# Altium schematic sheet DCAR_MCU.SchDoc: eBox_MCU
size A4; DocumentNumber: 3; SheetNumber: 3; SheetTotal: 7
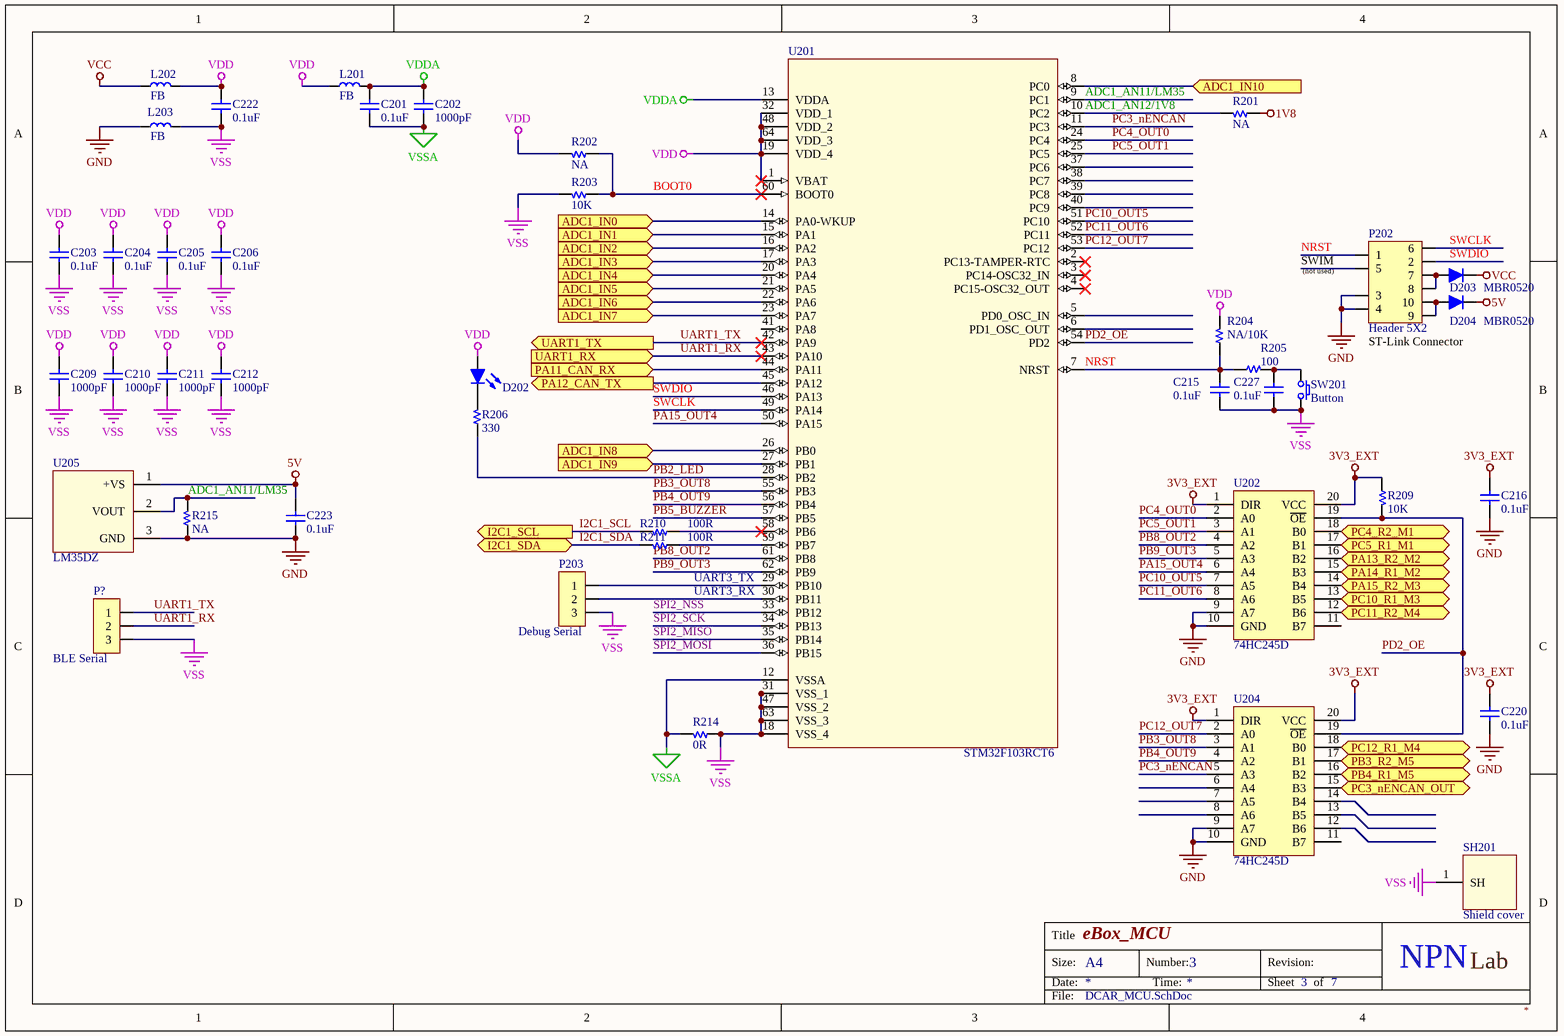
[diagram p0: DCAR_MCU.SchDoc]

## Parts
C201  0.1uF  [C 0603]
C202  1000pF  [C 0603]
C203  0.1uF  [C 0603]
C204  0.1uF  [C 0603]
C205  0.1uF  [C 0603]
C206  0.1uF  [C 0603]
C209  1000pF  [C 0603]
C210  1000pF  [C 0603]
C211  1000pF  [C 0603]
C212  1000pF  [C 0603]
C215  0.1uF  [C 0603]
C216  0.1uF  [C 0603]
C220  0.1uF  [C 0603]
C222  0.1uF  [C 0805]
C223  0.1uF  [C 0603]
C227  0.1uF  [C 0603]
D202  5V Led  [LED 3MM - blue]  (value not drawn)
D203  MBR0520  [SOD123]
D204  MBR0520  [SOD123]
L201  FB  [L 0805 (2012)]
L202  FB  [L 0805 (2012)]
L203  FB  [L 0805 (2012)]
P202  Header 5X2  [HDR/Header/10/DL/BOX]
P203  Debug Serial  [HDR/Header/3]
P?  BLE Serial  [HDR/Header/3]
R201  NA  [R 0603]
R202  NA  [R 0603]
R203  10K  [R 0603]
R204  NA/10K  [R 0603]
R205  100  [R 0603]
R206  330  [R 0603]
R209  10K  [R 0603]
R210  100R  [R 0603]
R211  100R  [R 0603]
R214  0R  [R 0603]
R215  NA  [R 0603]
SH201  Shield cover  [SHIELD COVER 50x35]  (no BOM)
SW201  Button  [SW/2/DIP]
U201  STM32F103RCT6  [STM-LQFP64]
U202  74HC245D  [SOIC-20]
U204  74HC245D  [SOIC-20]
U205  LM35DZ  [TO-92/W100]

## Ports
ADC1_IN0 (in), ADC1_IN1 (in), ADC1_IN2 (in), ADC1_IN3 (in), ADC1_IN4 (in), ADC1_IN5 (in), ADC1_IN6 (in), ADC1_IN7 (in), ADC1_IN8 (in), ADC1_IN9 (in), ADC1_IN10 (in), I2C1_SCL (out), I2C1_SDA (bidir), PA11_CAN_RX (in), PA12_CAN_TX (out), PA13_R2_M2 (out), PA14_R1_M2 (out), PA15_R2_M3 (out), PB3_R2_M5 (out), PB4_R1_M5 (out), PC3_nENCAN_OUT (out), PC4_R2_M1 (out), PC5_R1_M1 (out), PC10_R1_M3 (out), PC11_R2_M4 (out), PC12_R1_M4 (out), UART1_RX (in), UART1_TX (out)

## Nets
1V8: R201.1
3V3_EXT: C216.1 C220.1 R209.1 U202.1(DIR) U202.20(VCC) U204.1(DIR) U204.20(VCC)
5V: C223.1 D204.2(K) U205.1(+VS)
GND: C216.2 C220.2 C223.2 L203.1 P202.3 P202.4 R215.1 U202.9(A7) U202.10(GND) U204.9(A7) U204.10(GND) U205.3(GND)
VCC: D203.2(K) L202.1
VDD: C203.1 C204.1 C205.1 C206.1 C209.1 C210.1 C211.1 C212.1 C222.1 D202.1(A) L201.1 L202.2 R202.2 R204.2 U201.1(VBAT) U201.19(VDD_4) U201.32(VDD_1) U201.48(VDD_2) U201.64(VDD_3)
VDDA: C201.1 C202.1 L201.2 U201.13(VDDA)
VSS: C203.2 C204.2 C205.2 C206.2 C209.2 C210.2 C211.2 C212.2 C215.2 C222.2 C227.2 L203.2 P203.3 P?.3 R203.2 R214.1 SH201.1(SH) SW201.2 U201.18(VSS_4) U201.31(VSS_1) U201.47(VSS_2) U201.63(VSS_3)
VSSA: C201.2 C202.2 R214.2 U201.12(VSSA)
ADC1_AN11/LM35: R215.2 U201.9(PC1) U205.2(VOUT)
ADC1_AN12/1V8: R201.2 U201.10(PC2)
ADC1_IN0: U201.14(PA0-WKUP) ; port ADC1_IN0
ADC1_IN1: U201.15(PA1) ; port ADC1_IN1
ADC1_IN2: U201.16(PA2) ; port ADC1_IN2
ADC1_IN3: U201.17(PA3) ; port ADC1_IN3
ADC1_IN4: U201.20(PA4) ; port ADC1_IN4
ADC1_IN5: U201.21(PA5) ; port ADC1_IN5
ADC1_IN6: U201.22(PA6) ; port ADC1_IN6
ADC1_IN7: U201.23(PA7) ; port ADC1_IN7
ADC1_IN8: U201.26(PB0) ; port ADC1_IN8
ADC1_IN9: U201.27(PB1) ; port ADC1_IN9
ADC1_IN10: U201.8(PC0) ; port ADC1_IN10
BOOT0: R202.1 R203.1 U201.60(BOOT0)
I2C1_SCL: R210.2 ; port I2C1_SCL
I2C1_SDA: R211.2 ; port I2C1_SDA
NRST: C215.1 P202.1 R204.1 R205.1 U201.7(NRST)
PA11_CAN_RX: U201.44(PA11) ; port PA11_CAN_RX
PA12_CAN_TX: U201.45(PA12) ; port PA12_CAN_TX
PA13_R2_M2: U202.16(B2) ; port PA13_R2_M2
PA14_R1_M2: U202.15(B3) ; port PA14_R1_M2
PA15_OUT4: U201.50(PA15) U202.6(A4)
PA15_R2_M3: U202.14(B4) ; port PA15_R2_M3
PB2_LED: R206.1 U201.28(PB2)
PB3_OUT8: U201.55(PB3) U204.3(A1)
PB3_R2_M5: U204.17(B1) ; port PB3_R2_M5
PB4_OUT9: U201.56(PB4) U204.4(A2)
PB4_R1_M5: U204.16(B2) ; port PB4_R1_M5
PB5_BUZZER: U201.57(PB5)
PB8_OUT2: U201.61(PB8) U202.4(A2)
PB9_OUT3: U201.62(PB9) U202.5(A3)
PC3_nENCAN: U201.11(PC3) U204.5(A3)
PC3_nENCAN_OUT: U204.15(B3) ; port PC3_nENCAN_OUT
PC4_OUT0: U201.24(PC4) U202.2(A0)
PC4_R2_M1: U202.18(B0) ; port PC4_R2_M1
PC5_OUT1: U201.25(PC5) U202.3(A1)
PC5_R1_M1: U202.17(B1) ; port PC5_R1_M1
PC10_OUT5: U201.51(PC10) U202.7(A5)
PC10_R1_M3: U202.13(B5) ; port PC10_R1_M3
PC11_OUT6: U201.52(PC11) U202.8(A6)
PC11_R2_M4: U202.12(B6) ; port PC11_R2_M4
PC12_OUT7: U201.53(PC12) U204.2(A0)
PC12_R1_M4: U204.18(B0) ; port PC12_R1_M4
PD2_OE: R209.2 U201.54(PD2) U202.19(~{OE}) U204.19(~{OE})
SPI2_MISO: U201.35(PB14)
SPI2_MOSI: U201.36(PB15)
SPI2_NSS: U201.33(PB12)
SPI2_SCK: U201.34(PB13)
SWCLK: P202.6 U201.49(PA14)
SWDIO: P202.2 U201.46(PA13)
UART1_RX: P?.2 U201.43(PA10) ; port UART1_RX
UART1_TX: P?.1 U201.42(PA9) ; port UART1_TX
UART3_RX: P203.2 U201.30(PB11)
UART3_TX: P203.1 U201.29(PB10)
NetC227_1: C227.1 R205.2 SW201.1
NetD202_2: D202.2(K) R206.2
NetD203_1: D203.1(A) P202.7 P202.8
NetD204_1: D204.1(A) P202.9 P202.10
NetR210_1: R210.1 U201.58(PB6)
NetR211_1: R211.1 U201.59(PB7)

Not connected (* = marked no-connect by the designer): P202 5; U201 2(PC13-TAMPER-RTC)* 3(PC14-OSC32_IN)* 4(PC15-OSC32_OUT)* 5(PD0_OSC_IN) 6(PD1_OSC_OUT) 37(PC6) 38(PC7) 39(PC8) 40(PC9) 41(PA8); U202 11(B7); U204 6(A4) 7(A5) 8(A6) 11(B7) 12(B6) 13(B5) 14(B4)

## Notes on the sheet
- (near P202) SWIM
- (near P202) (not used)
- ST-Link Connector
- Title
- Size:
- Date:
- A4
- Number:
- Time:
- Revision:
- Sheet
- of
- NPN
- Lab
- File:

## Library data of the parts
C201-C206 C209-C212 C215 C216 C220 C222 C223 C227 = Capacitor NP: CAP CER 0.1UF 50V X7R 0603; TYPE: SMD; PACKAGE: SMD0603; STOCK CODE: CC0603KRX7R9BB104; SUPPLIER: tme.vn; STOCK DESC: 100nF/50V ±10% X7R SMD-0603 Capacitor; UNIT PRICE: 400
D202 = Led: LED RED CLEAR 0603 SMD; TYPE: TH; PACKAGE: 3MM; STOCK CODE: HT204SURD; SUPPLIER: tme.vn; STOCK DESC: 3mm Base LED; UNIT PRICE: 300
D203 D204 = Diode: Default Diode
L201-L203 = Inductor
P202 = Header 5X2: Header, 5-Pin, Dual row; UNIT PRICE: 0
P203 P? = Header 3: Header, 3-Pin; UNIT PRICE: 0
R201-R205 R209 = Resistor: RES SMD 10K OHM 1% 1/10W 0603; PACKAGE: SMD0603
  R201 R204: TYPE: N/A; UNIT PRICE: 0
  R202 R203 R205 R209: STOCK CODE: RM06JTN103; SUPPLIER: tme.vn; TYPE: SMD; STOCK DESC: 10K ±5% SMD-0603 Resistor; UNIT PRICE: 50
R206 = Resistor: RES SMD 330 OHM 1% 1/10W 0603; PACKAGE: SMD0603; STOCK CODE: RM06JTN331; SUPPLIER: tme.vn; TYPE: SMD; STOCK DESC: 330R ±5% SMD-0603 Resistor; UNIT PRICE: 50
R210 R211 R214 = Resistor: RES SMD 4.7K OHM 1% 1/10W 0603; PACKAGE: SMD0603; STOCK CODE: RM06JTN472; SUPPLIER: tme.vn; TYPE: SMD; STOCK DESC: 4.7K ±5% SMD-0603 Resistor; UNIT PRICE: 50
R215 = Resistor: RES SMD ? OHM 1% 1/10W 0603; PACKAGE: SMD0603; TYPE: N/A; UNIT PRICE: 0
SW201 = SW SPST: Tact switch 2 pin; STOCK CODE: KAN0611-0501B; SUPPLIER: tme.vn; TYPE: TH; STOCK DESC: Tact Switch 6x6x5 mm Black; UNIT PRICE: 1000
U201 = STM32F103RBT6: Mainstream Performance line, ARM Cortex-M3 MCU with 128 Kbytes Flash, 72 MHz CPU, motor control, USB and CAN; Package: LQFP-64; PART NO: STM32F103RCT6; STOCK CODE: STM32F103RCT6; SUPPLIER: tme.vn; TYPE: SMD; STOCK DESC: MCU ARM 256KB FLASH LQFP-64; UNIT PRICE: 70000
U202 U204 = 74HC245D: IC TRANSCVR NON-INVERT 6V 20SO; BRAND: NXP; PACKAGE: SOIC-20; STOCK CODE: 74HC245D; SUPPLIER: tme.vn; TYPE: SMD; STOCK DESC: Octal bus transceiver; 3-state, Non-Inverting; UNIT PRICE: 5000
U205 = LM35DZ: SENSOR ANALOG 0C-100C TO92-3; PACKAGE: TO-92; STOCK CODE: LM35DZ; SUPPLIER: tme.vn; TYPE: TH; STOCK DESC: Analog Thermometer; UNIT PRICE: 30000